# Altium schematic sheet 1_MCU.schdoc
size 312 x 225 mm; SheetNumber: 1; SheetTotal: 3
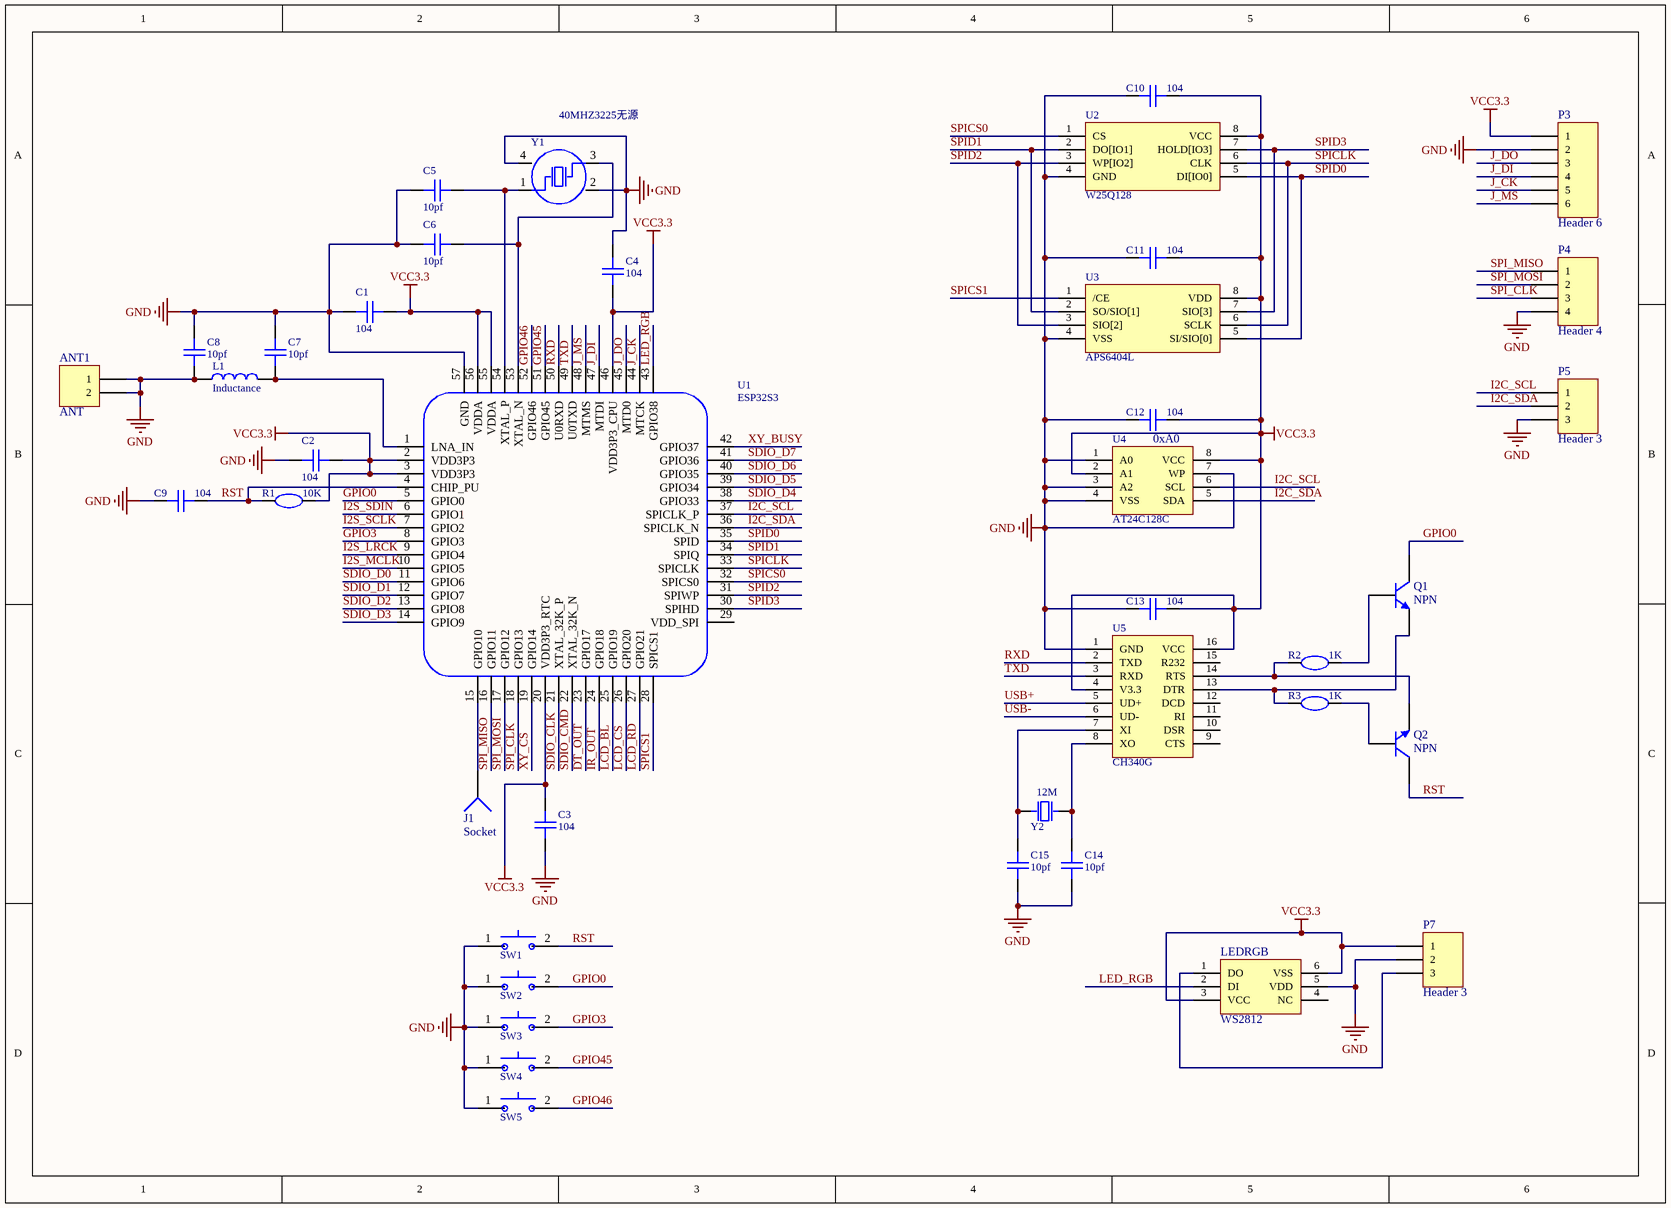
[diagram p0: 1_MCU.schdoc]

## Parts
ANT1  ANT  [MINI_ANT]
C1  104  [0402R]
C2  104  [0402R]
C3  104  [0402R]
C4  104  [0402R]
C5  10pf  [0603]
C6  10pf  [0603]
C7  10pf  [0603]
C8  10pf  [0603]
C9  104  [0402R]
C10  104  [0402R]
C11  104  [0402R]
C12  104  [0402R]
C13  104  [0402R]
C14  10pf  [0603]
C15  10pf  [0603]
J1  Socket  [PIN1]
L1  Inductance  [0603]
LEDRGB  WS2812  [LED-SMD_6P-L5.0-W5.0-TL]
P3  Header 6  [HDR1X6]
P4  Header 4  [HDR1X4]
P5  Header 3  [HDR1X3]
P7  Header 3  [HDR1X3]
Q1  NPN  [SOT-23-3_L2.9-W1.3-P1.90-LS2.4-BR]
Q2  NPN  [SOT-23-3_L2.9-W1.3-P1.90-LS2.4-BR]
R1  10K  [0402R]
R2  1K  [0402R]
R3  1K  [0402R]
SW1  无声微动开关  [SW-SMD_L6.0-W6.0-P6.00-LS6.6]  (value not drawn)
SW2  无声微动开关  [SW-SMD_L6.0-W6.0-P6.00-LS6.6]  (value not drawn)
SW3  无声微动开关  [SW-SMD_L6.0-W6.0-P6.00-LS6.6]  (value not drawn)
SW4  无声微动开关  [SW-SMD_L6.0-W6.0-P6.00-LS6.6]  (value not drawn)
SW5  无声微动开关  [SW-SMD_L6.0-W6.0-P6.00-LS6.6]  (value not drawn)
U1  ESP32S3  [ESP32-S3-QFN56]
U2  W25Q128  [SOIC-8_L5.3-W5.3-P1.27-LS8.0-BL]
U3  APS6404L  [SOP-8_L4.9-W3.9-P1.27-LS6.0-BL]
U4  AT24C128C  [SOIC-8_L4.9-W3.9-P1.27-LS6.0-BL]
U5  CH340G  [CH340G]
Y1  Name: 40MHZ3225无源  [CRYSTAL-SMD_4P-L3.2-W2.5-BL]  (hidden comment: CRYSTAL1)
Y2  12M  [HC-49US_L11.5-W4.5-P4.88]

## Nets
GND: ANT1.1 ANT1.2 C1.1 C2.1 C3.1 C4.2 C5.1 C6.1 C7.2 C8.1 C8.2 C9.1 C10.1 C11.1 C12.1 C13.1 C14.1 C15.1 L1.1 LEDRGB.5(VDD) P3.2 P4.4 P5.3 P7.2 SW1.1 SW2.1 SW3.1 SW4.1 SW5.1 U1.57(GND) U2.4(GND) U3.4(VSS) U4.1(A0) U4.3(A2) U4.4(VSS) U4.7(WP) U5.1(GND) Y1.2(GND) Y1.4(GND)
VCC3.3: C1.2 C2.2 C3.2 C4.1 C10.2 C11.2 C12.2 C13.2 LEDRGB.3(VCC) LEDRGB.6(VSS) P3.1 P7.1 R1.2 U1.2(VDD3P3) U1.3(VDD3P3) U1.20(VDD3P3_RTC) U1.46(VDD3P3_CPU) U1.55(VDDA) U1.56(VDDA) U2.8(VCC) U3.8(VDD) U4.2(A1) U4.8(VCC) U5.4(V3.3) U5.16(VCC)
DT_OUT: U1.23(GPIO17)
GPIO0: Q1.1(C) SW2.2 U1.5(GPIO0)
GPIO3: SW3.2 U1.8(GPIO3)
GPIO45: SW4.2 U1.51(GPIO45)
GPIO46: SW5.2 U1.52(GPIO46)
I2C_SCL: P5.1 U1.37(SPICLK_P) U4.6(SCL)
I2C_SDA: P5.2 U1.36(SPICLK_N) U4.5(SDA)
I2S_LRCK: U1.9(GPIO4)
I2S_MCLK: U1.10(GPIO5)
I2S_SCLK: U1.7(GPIO2)
I2S_SDIN: U1.6(GPIO1)
IR_OUT: U1.24(GPIO18)
J_CK: P3.5 U1.44(MTCK)
J_DI: P3.4 U1.47(MTDI)
J_DO: P3.3 U1.45(MTD0)
J_MS: P3.6 U1.48(MTMS)
LCD_BL: U1.25(GPIO19)
LCD_CS: U1.26(GPIO20)
LCD_R~{D}: U1.27(GPIO21)
LED_RGB: LEDRGB.2(DI) U1.43(GPIO38)
RST: C9.2 Q2.1(C) R1.1 SW1.2 U1.4(CHIP_PU)
RXD: U1.50(U0RXD) U5.2(TXD)
SDIO_CLK: U1.21(XTAL_32K_P)
SDIO_CMD: U1.22(XTAL_32K_N)
SDIO_D0: U1.11(GPIO6)
SDIO_D1: U1.12(GPIO7)
SDIO_D2: U1.13(GPIO8)
SDIO_D3: U1.14(GPIO9)
SDIO_D4: U1.38(GPIO33)
SDIO_D5: U1.39(GPIO34)
SDIO_D6: U1.40(GPIO35)
SDIO_D7: U1.41(GPIO36)
SPI_CLK: P4.3 U1.18(GPIO13)
SPI_MISO: P4.1 U1.16(GPIO11)
SPI_MOSI: P4.2 U1.17(GPIO12)
SPICLK: U1.33(SPICLK) U2.6(CLK) U3.6(SCLK)
SPICS0: U1.32(SPICS0) U2.1(CS)
SPICS1: U1.28(SPICS1) U3.1(/CE)
SPID0: U1.35(SPID) U2.5(DI[IO0]) U3.5(SI/SIO[0])
SPID1: U1.34(SPIQ) U2.2(DO[IO1]) U3.2(SO/SIO[1])
SPID2: U1.31(SPIWP) U2.3(WP[IO2]) U3.3(SIO[2])
SPID3: U1.30(SPIHD) U2.7(HOLD[IO3]) U3.7(SIO[3])
TXD: U1.49(U0TXD) U5.3(RXD)
USB+: U5.5(UD+)
USB-: U5.6(UD-)
XY_BUSY: U1.42(GPIO37)
XY_CS: U1.19(GPIO14)
NetC5_2: C5.2 U1.54(XTAL_P) Y1.1(OSC1)
NetC6_2: C6.2 U1.53(XTAL_N) Y1.3(OSC2)
NetC7_1: C7.1 L1.2 U1.1(LNA_IN)
NetC14_2: C14.2 U5.8(XO) Y2.2(OSC2)
NetC15_2: C15.2 U5.7(XI) Y2.1(OSC1)
NetJ1_1: J1.1 U1.15(GPIO10)
NetLEDRGB_1: LEDRGB.1(DO) P7.3
NetQ1_2: Q1.2(B) R2.2
NetQ1_3: Q1.3(E) R3.1 U5.13(DTR)
NetQ2_2: Q2.2(B) R3.2
NetQ2_3: Q2.3(E) R2.1 U5.14(RTS)

Not connected (* = marked no-connect by the designer): LEDRGB 4(NC); U1 29(VDD_SPI); U5 9(CTS) 10(DSR) 11(RI) 12(DCD) 15(R232)

## Notes on the sheet
- 0xA0

## Library data of the parts
ANT1 = Header 2: LatestRevisionDate: 17-Jul-2002; LatestRevisionNote: Re-released for DXP Platform.; Publisher: Altium Limited
C1-C15 = CAP: Symbol: 0.1u; Add into BOM: yes; Origin Footprint: C0805; Device: 0.1u; Convert to PCB: yes
L1 = Inductance: Symbol: 1m; Add into BOM: yes; Origin Footprint: L1608; Device: 1m; Convert to PCB: yes
P3 = Header 6: Header, 6-Pin; LatestRevisionDate: 17-Jul-2002; LatestRevisionNote: Re-released for DXP Platform.; Publisher: Altium Limited
P4 = Header 4: Header, 4-Pin; LatestRevisionDate: 17-Jul-2002; LatestRevisionNote: Re-released for DXP Platform.; Publisher: Altium Limited
P5 P7 = Header 3: Header, 3-Pin; LatestRevisionDate: 17-Jul-2002; LatestRevisionNote: Re-released for DXP Platform.; Publisher: Altium Limited
Q1 Q2 = NPN: NPN Bipolar Transistor; Published: 8-Jun-2000; LatestRevisionDate: 17-Jul-2002; LatestRevisionNote: Re-released for DXP Platform.; PackageReference: TO-226-AA; Publisher: Altium Limited; PackageDescription: TO, Flat Index; 3 In-Line, Axial Leads; Body Dia. 4.8mm; Leads 0.55 x 0.51 mm (max); Code_JEDEC: TO-226-AA
R1-R3 = RST: Symbol: 0_; Add into BOM: yes; Origin Footprint: R0805; Device: 0_; Convert to PCB: yes
SW1-SW5 = SW: Add into BOM: yes; Symbol: 无声微动开关; Name: 无声微动开关; Device: 无声微动开关; Convert to PCB: yes; Origin Footprint: SW-SMD_L6.0-W6.0-P6.00-LS6.6
U1 = ESP32S3: Add into BOM: yes; Symbol: ESP32S3; Device: ESP32S3; Convert to PCB: yes; Origin Footprint: ESP32-S3-QFN56
U2 = W25Q128: Symbol: W25Q128JVSIQ; Add into BOM: yes; Device: W25Q128JVSIQ; Convert to PCB: yes; Origin Footprint: SOIC-8_L5.3-W5.3-P1.27-LS8.0-BL
U3 = APS6404L: Symbol: APS6404L-3SQR-SN; Add into BOM: yes; Device: APS6404L-3SQR-SN; Convert to PCB: yes; Origin Footprint: SOP-8_L4.9-W3.9-P1.27-LS6.0-BL; link: https://img.jlc.com/pdf/applyPasteComponent/2021-12-06/31098A/66796366ab5e49f0a48d07582eff2f2b/APS6404L-3SQR-SN.pdf
U4 = AT24C128C: Symbol: AT24C128C-SSHM-T; Add into BOM: yes; Device: AT24C128C-SSHM-T; Convert to PCB: yes; Origin Footprint: SOIC-8_L4.9-W3.9-P1.27-LS6.0-BL
U5 = CH340G: Add into BOM: yes; Symbol: CH340G; Device: CH340G; Convert to PCB: yes; Origin Footprint: CH340G
Y1 = CRYSTAL1: Symbol: 25MHZ3225无源; Add into BOM: yes; Device: 25MHZ3225无源; Convert to PCB: yes; Origin Footprint: CRYSTAL-SMD_4P-L3.2-W2.5-BL
Y2 = CRYSTAL: Symbol: 9B-12.288MAAJ-B; Add into BOM: yes; Name: 9B-12.288MAAJ-B; Device: 9B-12.288MAAJ-B; Convert to PCB: yes; Origin Footprint: HC-49US_L11.5-W4.5-P4.88
J1 = Socket: LatestRevisionDate: 17-Jul-2002; LatestRevisionNote: Re-released for DXP Platform.; Publisher: Altium Limited